# Altium schematic sheet ATMEGA8A.SchDoc
size A4; DocumentNumber: 2; SheetNumber: 2; SheetTotal: 8
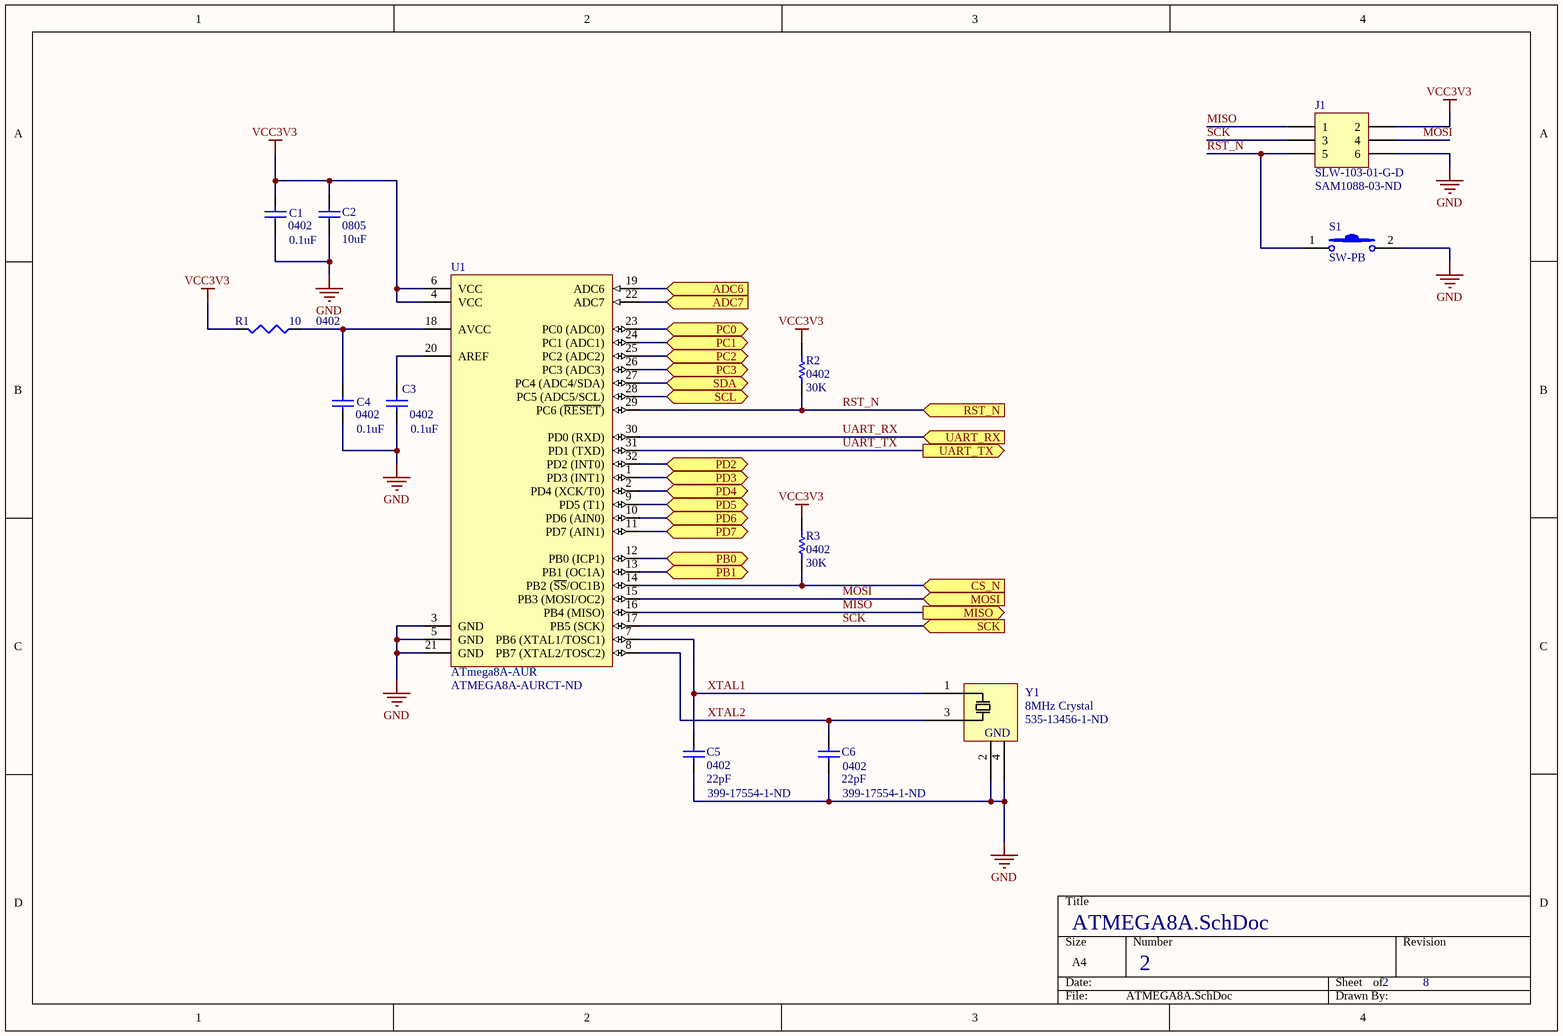
[diagram p0: ATMEGA8A.SchDoc]

## Parts
C1  0402  value 0.1uF  [CAP0402R]
C2  0805  value 10uF  [CAP0805R]
C3  0402  value 0.1uF  [CAP0402R]
C4  0402  value 0.1uF  [CAP0402R]
C5  0402  value 22pF  Supplier Part Number 1: 399-17554-1-ND  [CAP0402R]
C6  0402  value 22pF  Supplier Part Number 1: 399-17554-1-ND  [CAP0402R]
J1  SLW-103-01-G-D  Supplier Part Number 1: SAM1088-03-ND  [SLW-103-01-X-D]
R1  0402  value 10  [RES0402R]
R2  0402  value 30K  [RES0402R]
R3  0402  value 30K  [RES0402R]
S1  SW-PB  [PTS830GM140 SMTR LFS - Pushbutton]
U1  ATmega8A-AUR  Supplier Part Number 1: ATMEGA8A-AURCT-ND  [QFP80P900X900X120-32]
Y1  8MHz Crystal  Supplier Part Number 1: 535-13456-1-ND  [OSCSC500X320X110-4N]

## Ports
ADC6 (in), ADC7 (in), CS_N (in), MISO (out), MOSI (in), PB0 (bidir), PB1 (bidir), PC0 (bidir), PC1 (bidir), PC2 (bidir), PC3 (bidir), PD2 (bidir), PD3 (bidir), PD4 (bidir), PD5 (bidir), PD6 (bidir), PD7 (bidir), RST_N (in), SCK (in), SCL (bidir), SDA (bidir), UART_RX (in), UART_TX (out)

## Nets
GND: C1.1 C2.1 C3.1 C4.1 C5.1 C6.1 J1.6 S1.2 U1.3(GND) U1.5(GND) U1.21(GND) Y1.2 Y1.4
VCC3V3: C1.2 C2.2 J1.2 R1.2 R2.2 R3.2 U1.4(VCC) U1.6(VCC)
ADC6: U1.19(ADC6) ; port ADC6
ADC7: U1.22(ADC7) ; port ADC7
CS_N: R3.1 U1.14(PB2_(~{SS}/OC1B)) ; port CS_N
MISO: J1.1 U1.16(PB4_(MISO)) ; port MISO
MOSI: J1.4 U1.15(PB3_(MOSI/OC2)) ; port MOSI
PB0: U1.12(PB0_(ICP1)) ; port PB0
PB1: U1.13(PB1_(OC1A)) ; port PB1
PC0: U1.23(PC0_(ADC0)) ; port PC0
PC1: U1.24(PC1_(ADC1)) ; port PC1
PC2: U1.25(PC2_(ADC2)) ; port PC2
PC3: U1.26(PC3_(ADC3)) ; port PC3
PD2: U1.32(PD2_(INT0)) ; port PD2
PD3: U1.1(PD3_(INT1)) ; port PD3
PD4: U1.2(PD4_(XCK/T0)) ; port PD4
PD5: U1.9(PD5_(T1)) ; port PD5
PD6: U1.10(PD6_(AIN0)) ; port PD6
PD7: U1.11(PD7_(AIN1)) ; port PD7
RST_N: J1.5 R2.1 S1.1 U1.29(PC6_(~{RESET})) ; port RST_N
SCK: J1.3 U1.17(PB5_(SCK)) ; port SCK
SCL: U1.28(PC5_(ADC5/SCL)) ; port SCL
SDA: U1.27(PC4_(ADC4/SDA)) ; port SDA
UART_RX: U1.30(PD0_(RXD)) ; port UART_RX
UART_TX: U1.31(PD1_(TXD)) ; port UART_TX
XTAL1: C5.2 U1.7(PB6_(XTAL1/TOSC1)) Y1.1(IN)
XTAL2: C6.2 U1.8(PB7_(XTAL2/TOSC2)) Y1.3(IN)
NetC3_2: C3.2 U1.20(AREF)
NetC4_2: C4.2 R1.1 U1.18(AVCC)

## Notes on the sheet
- (in symbol AMB3B-8MHz) GND

## Library data of the parts
C1 C3 C4 = Cap Semi: Capacitor (Semiconductor SIM Model); Manufacturer: Murata; Manufacturer Part Number: GCM155R71C104KA55J; Capacitance: 100nF; Tolerance: 10%; Voltage Rating: 16V; Dielectric: X7R; Published: 8-Jun-2000; LatestRevisionDate: 29-May-2009; LatestRevisionNote: IPC-7351 Footprint Added.; PackageReference: C1206; Publisher: Altium Limited; PackageDescription: Chip Capacitor; Supplier 1: Digi-Key; Supplier Part Number 1: 587-3807-1-ND; Supplier 2: Digi-Key; Supplier Part Number 2: 490-7998-1-ND; Stock 2: 5962647; Pricing 2: 1=0.1, 10=0.058, 100=0.026, 500=0.01858, 1000=0.0146, 2500=0.01328, 5000=0.01221 (USD); Mount: Surface Mount; Case/Package: 0402; Case Code (Imperial): 0402; Case Code (Metric): 1005; Min Operating Temperature: -55°C; Max Operating Temperature: 125°C; Voltage Rating (DC): 16V; Packaging: Tape and Reel; Package Quantity: 1; Termination: SMD/SMT; Length: 1mm; Height: 0.5mm; Width: 0.5mm; Thickness: 0.022inch; Depth: 0.5mm; Ratings: AEC-Q200; Radiation Hardening: No; Lead Free: Lead Free; ComponentLink1URL: http://psearch.murata.com/capacitor/product/GCM155R71C104KA55%23.pdf?src-supplier=Avnet; ComponentLink1Description: http://psearch.murata.com/capacitor/product/GCM155R71C104KA55%23.pdf?src-supplier=Avnet; ComponentLink2URL: http://www1.futureelectronics.com/doc/MURATA/GCM155R71C104KA55J.pdf?src-supplier=Future+Electronics; ComponentLink2Description: http://www1.futureelectronics.com/doc/MURATA/GCM155R71C104KA55J.pdf?src-supplier=Future+Electronics; ComponentLink3URL: http://psearch.en.murata.com/capacitor/product/GCM155R71C104KA55%23.pdf?src-supplier=Digi-Key; ComponentLink3Description: http://psearch.en.murata.com/capacitor/product/GCM155R71C104KA55%23.pdf?src-supplier=Digi-Key; ComponentLink4URL: http://search.murata.co.jp/Ceramy/image/img/A01X/partnumbering_e_02.pdf?src-supplier=Digi-Key; ComponentLink4Description: http://search.murata.co.jp/Ceramy/image/img/A01X/partnumbering_e_02.pdf?src-supplier=Digi-Key
  C3: Supplier 3: Digi-Key; Supplier Part Number 3: 399-17704-1-ND; Stock 3: 396535; Pricing 3: 1=0.17, 10=0.12, 100=0.0564, 500=0.03952, 1000=0.03273 (USD)
C2 = Cap: Capacitor; Manufacturer: TDK; Manufacturer Part Number: CGA4J1X7R0J106K125AC; Voltage Rating: 6.3V; Tolerance: 10%; Dielectric: X7R; Published: 8-Jun-2000; LatestRevisionDate: 17-Jul-2002; LatestRevisionNote: Re-released for DXP Platform.; PackageReference: RAD-0.3; Publisher: Altium Limited; PackageDescription: Radial Cap, Thru-Hole; 2 Leads; 0.3 in Pin Spacing; Supplier 1: Digi-Key; Supplier Part Number 1: 445-6971-1-ND; Stock 1: 793917; Pricing 1: 1=0.48, 10=0.331, 100=0.1984, 500=0.14878, 1000=0.12564 (USD); Mount: Surface Mount; Case/Package: 0805; Weight: 0.000194oz; Case Code (Metric): 2012; Case Code (Imperial): 0805; Min Operating Temperature: -55°C; Max Operating Temperature: 125°C; Package Quantity: 1; Capacitance: 10uF; Packaging: Tape and Reel; Voltage Rating (DC): 6.3V; Termination: SMD/SMT; Composition: Ceramic; Length: 2mm; Height: 1.25mm; Width: 0.049inch; Thickness: 0.057inch; Depth: 1.25mm; Ratings: AEC-Q200; REACH SVHC: No SVHC; Lead Free: Lead Free; ComponentLink1URL: http://www.farnell.com/datasheets/1807242.pdf?src-supplier=Element14; ComponentLink1Description: http://www.farnell.com/datasheets/1807242.pdf?src-supplier=Element14; ComponentLink2URL: http://product.tdk.com/capacitor/mlcc/detailed_information.php?lang=en&amp;ref=jp&amp;part_no=CGA4J1X7R0J106K125AC&src-supplier=Mouser; ComponentLink2Description: http://product.tdk.com/capacitor/mlcc/detailed_information.php?lang=en&amp;ref=jp&amp;part_no=CGA4J1X7R0J106K125AC&src-supplier=Mouser
C5 C6 = Cap: Capacitor; Manufacturer: KEMET; Manufacturer Part Number: C0402C220K4RAC7867; Tolerance: 10%; Voltage Rating: 16V; Published: 8-Jun-2000; LatestRevisionDate: 17-Jul-2002; LatestRevisionNote: Re-released for DXP Platform.; PackageReference: RAD-0.3; Publisher: Altium Limited; PackageDescription: Radial Cap, Thru-Hole; 2 Leads; 0.3 in Pin Spacing; Supplier 1: Digi-Key; Stock 1: 72125; Pricing 1: 1=0.19, 10=0.132, 100=0.062, 500=0.0435, 1000=0.03601, 2500=0.03351, 5000=0.03066 (USD); Mount: Surface Mount; Case/Package: 0402; Case Code (Imperial): 0402; Case Code (Metric): 1005; Min Operating Temperature: -55°C; Max Operating Temperature: 125°C; Packaging: Tape and Reel; Capacitance: 22pF
R1 = Res3: Resistor; Published: 8-Jun-2000; LatestRevisionDate: 29-May-2009; LatestRevisionNote: IPC-7351 Footprint Added.; PackageReference: J1-0603; Publisher: Altium Limited; PackageDescription: Chip Resistor; Supplier 1: Digi-Key
R2 R3 = Res1: Resistor; Published: 8-Jun-2000; LatestRevisionDate: 17-Jul-2002; LatestRevisionNote: Re-released for DXP Platform.; PackageReference: AXIAL-0.3; Publisher: Altium Limited; PackageDescription: Axial Device, Thru-Hole; 2 Leads; 0.3 in Pin Spacing; Supplier 1: Digi-Key
S1 = Pushbutton - Low Profile: Schematic symbol for a generic 2-pin pushbutton, OFF-mom.; Supplier 1: Digi-Key
U1 = ATMEGA8A-AUR: 8-bit AVR Microcontroller, 2.7-5.5V, 16MHz, 8KB Flash, 512 Bytes EEPROM, 1KB SRAM, 32-pin TQFP, Industrial Grade (-40°C to 85°C), Reel; ComponentLink1Description: Manufacturer URL; ComponentLink2Description: ATmega8A Datasheet; DatasheetVersion: revD, Feb-2011; ComponentLink3URL: http://www.atmel.com/dyn/resources/prod_documents/8159S.pdf; ComponentLink3Description: ATmega8A Summary; ComponentLink1URL: http://www.atmel.com/; Code_JEDEC: MS-026-ABA; PackageVersion: revC, Oct-2010; PackageDescription: 32-Lead, 7x7x1.0 mm Body, 0.8mm Lead Pitch, Thin Profile Plastic Quad Flat Package (TQFP); ComponentLink2URL: http://www.atmel.com/dyn/resources/prod_documents/doc8159.pdf; PackageReference: 32A; PartNumber: ATMEGA8A-AUR; Supplier 1: Digi-Key
Y1 = AMB3B-8MHz: 8MHz Abracom 4-pin crystal.; Supplier 1: Digi-Key
J1 = SLW-103-01-G-D: Supplier 1: Digi-Key